# Altium project LED Strip.PrjPcb
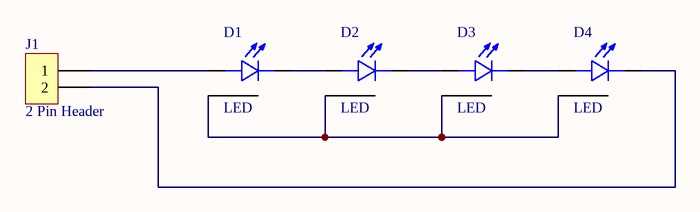
[diagram p0: 4_LED_strip.SchDoc]
1 sheet, 5 parts. Net scope: global (net labels, ports and power ports of the same name join across sheets).
Board file: 4_LED_strip_PCB.PcbDoc

## Sheet 4_LED_strip.SchDoc
size A

### Parts
D1  LED  [LED_SMD_CREE_3.45x3.45]
D2  LED  [LED_SMD_CREE_3.45x3.45]
D3  LED  [LED_SMD_CREE_3.45x3.45]
D4  LED  [LED_SMD_CREE_3.45x3.45]
J1  2 Pin Header  [2POS_SMD_2.5mm_CON]

### Nets
NetD1_3: D1.3(TH_PAD) D2.3(TH_PAD) D3.3(TH_PAD) D4.3(TH_PAD)
NetD1_A: D1.A J1.1
NetD1_C: D1.C D2.A
NetD2_C: D2.C D3.A
NetD3_C: D3.C D4.A
NetD4_C: D4.C J1.2